# EAGLE schematic Patch-Panel (EAGLE 8.2.2)
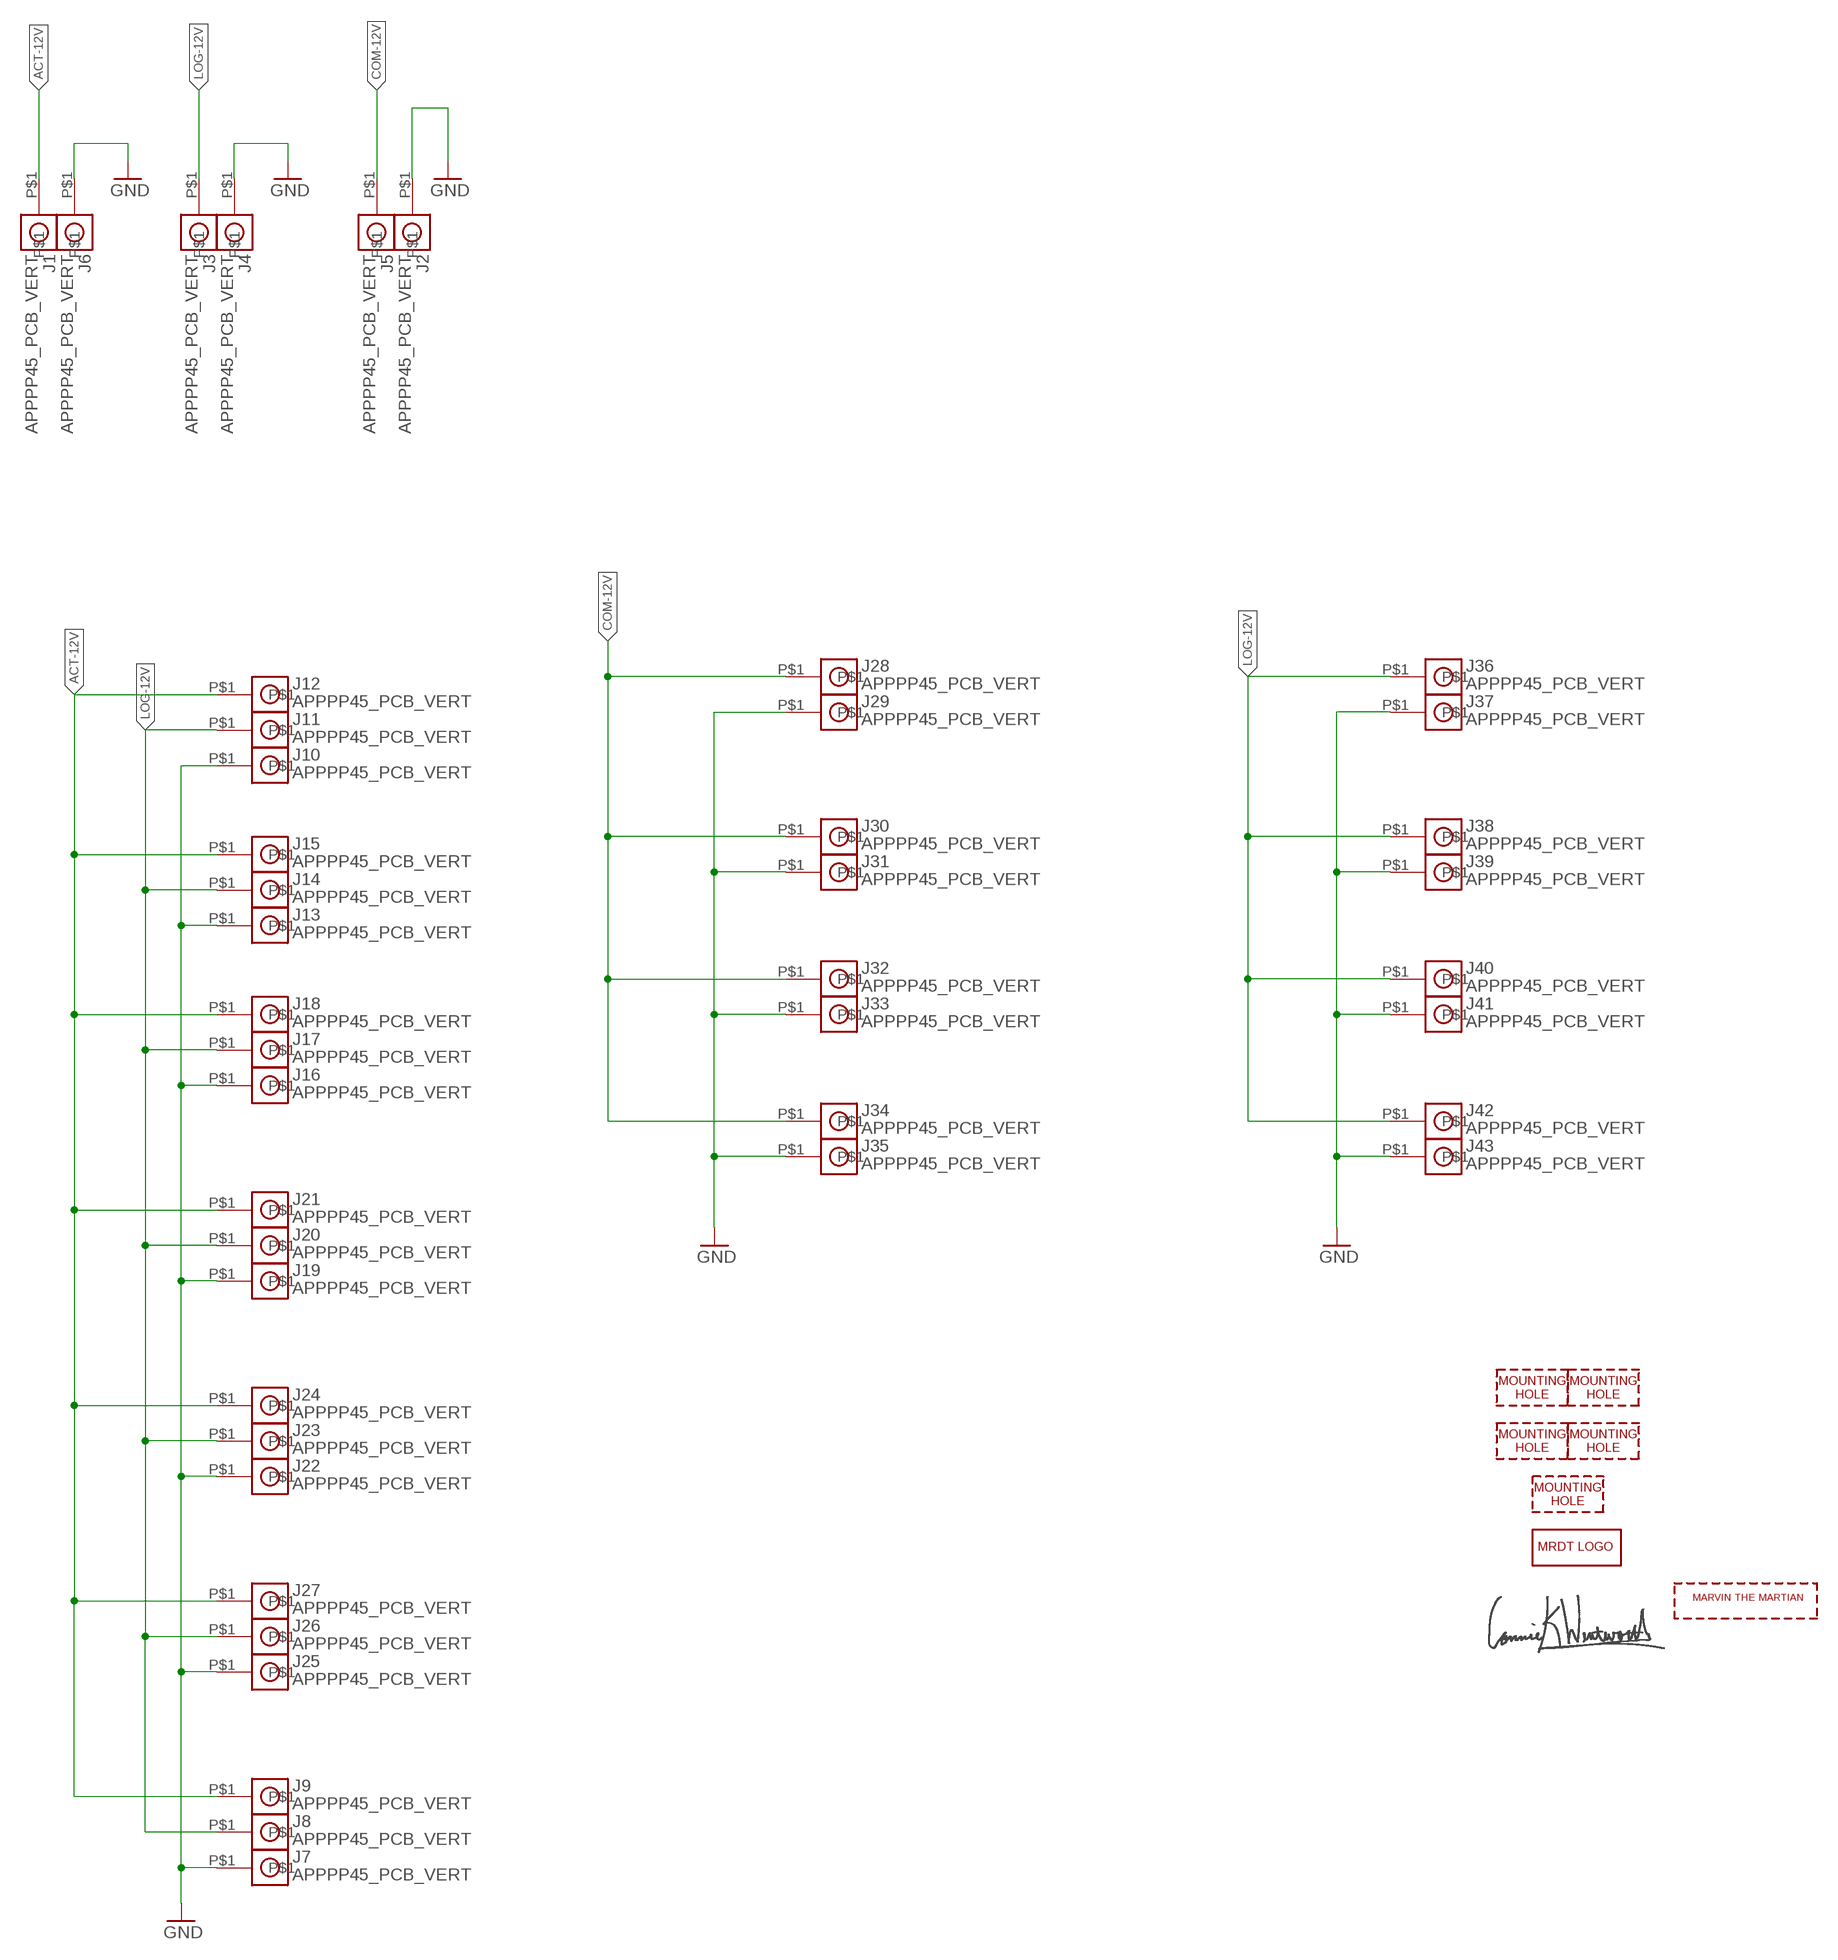
[diagram p0: schematic, sheet 1]

## Parts
H3  MOUNTING_HOLE#6  [#6_SCREW]
H4  MOUNTING_HOLE#6  [#6_SCREW]
H5  MOUNTING_HOLE#6  [#6_SCREW]
H6  MOUNTING_HOLE#6  [#6_SCREW]
H7  MOUNTING_HOLE#6  [#6_SCREW]
J1  APPPP45_PCB_VERT  [APP45_PCB_VERT]
J2  APPPP45_PCB_VERT  [APP45_PCB_VERT]
J3  APPPP45_PCB_VERT  [APP45_PCB_VERT]
J4  APPPP45_PCB_VERT  [APP45_PCB_VERT]
J5  APPPP45_PCB_VERT  [APP45_PCB_VERT]
J6  APPPP45_PCB_VERT  [APP45_PCB_VERT]
J7  APPPP45_PCB_VERT  [APP45_PCB_VERT]
J8  APPPP45_PCB_VERT  [APP45_PCB_VERT]
J9  APPPP45_PCB_VERT  [APP45_PCB_VERT]
J10  APPPP45_PCB_VERT  [APP45_PCB_VERT]
J11  APPPP45_PCB_VERT  [APP45_PCB_VERT]
J12  APPPP45_PCB_VERT  [APP45_PCB_VERT]
J13  APPPP45_PCB_VERT  [APP45_PCB_VERT]
J14  APPPP45_PCB_VERT  [APP45_PCB_VERT]
J15  APPPP45_PCB_VERT  [APP45_PCB_VERT]
J16  APPPP45_PCB_VERT  [APP45_PCB_VERT]
J17  APPPP45_PCB_VERT  [APP45_PCB_VERT]
J18  APPPP45_PCB_VERT  [APP45_PCB_VERT]
J19  APPPP45_PCB_VERT  [APP45_PCB_VERT]
J20  APPPP45_PCB_VERT  [APP45_PCB_VERT]
J21  APPPP45_PCB_VERT  [APP45_PCB_VERT]
J22  APPPP45_PCB_VERT  [APP45_PCB_VERT]
J23  APPPP45_PCB_VERT  [APP45_PCB_VERT]
J24  APPPP45_PCB_VERT  [APP45_PCB_VERT]
J25  APPPP45_PCB_VERT  [APP45_PCB_VERT]
J26  APPPP45_PCB_VERT  [APP45_PCB_VERT]
J27  APPPP45_PCB_VERT  [APP45_PCB_VERT]
J28  APPPP45_PCB_VERT  [APP45_PCB_VERT]
J29  APPPP45_PCB_VERT  [APP45_PCB_VERT]
J30  APPPP45_PCB_VERT  [APP45_PCB_VERT]
J31  APPPP45_PCB_VERT  [APP45_PCB_VERT]
J32  APPPP45_PCB_VERT  [APP45_PCB_VERT]
J33  APPPP45_PCB_VERT  [APP45_PCB_VERT]
J34  APPPP45_PCB_VERT  [APP45_PCB_VERT]
J35  APPPP45_PCB_VERT  [APP45_PCB_VERT]
J36  APPPP45_PCB_VERT  [APP45_PCB_VERT]
J37  APPPP45_PCB_VERT  [APP45_PCB_VERT]
J38  APPPP45_PCB_VERT  [APP45_PCB_VERT]
J39  APPPP45_PCB_VERT  [APP45_PCB_VERT]
J40  APPPP45_PCB_VERT  [APP45_PCB_VERT]
J41  APPPP45_PCB_VERT  [APP45_PCB_VERT]
J42  APPPP45_PCB_VERT  [APP45_PCB_VERT]
J43  APPPP45_PCB_VERT  [APP45_PCB_VERT]
LOGO1  MRDT_LOGO  [MRDT_LOGO]
U$1  CONNIE_WENTWORTH_SIGNATURE  [CONNIE_WENTWORTH_SIGNATURE]
U$2  MARVIN-THE-MARTIAN  [MARVIN]

## Nets
ACT-12V: J1.P$1 J9.P$1 J12.P$1 J15.P$1 J18.P$1 J21.P$1 J24.P$1 J27.P$1
COM-12V: J5.P$1 J28.P$1 J30.P$1 J32.P$1 J34.P$1
GND: J2.P$1 J4.P$1 J6.P$1 J7.P$1 J10.P$1 J13.P$1 J16.P$1 J19.P$1 J22.P$1 J25.P$1 J29.P$1 J31.P$1 J33.P$1 J35.P$1 J37.P$1 J39.P$1 J41.P$1 J43.P$1
LOG-12V: J3.P$1 J8.P$1 J11.P$1 J14.P$1 J17.P$1 J20.P$1 J23.P$1 J26.P$1 J36.P$1 J38.P$1 J40.P$1 J42.P$1

## Library data of the parts
H3-H7 = MRDT-Hardware:MOUNTING_HOLE: Mounting hole for M6 bolt. Standard use mounting hole for: Tiva C Connected - M6 Anderson Powerpole Mounting Wing - M8 Most frame-mounted PCB's - M8
J1-J43 = MRDT-Connectors:APP: http://www.powerwerx.com/anderson-powerpoles/
LOGO1 = MRDT-Hardware:MRDT_LOGO
U$1 = MRDT-Signatures:CONNIE_WENTWORTH_SIGNATURE
U$2 = MRDT-Hardware:MARVIN-THE-MARTIAN